# EAGLE design Output_v1.1 (EAGLE 9.6.1)
Assembly variants: test
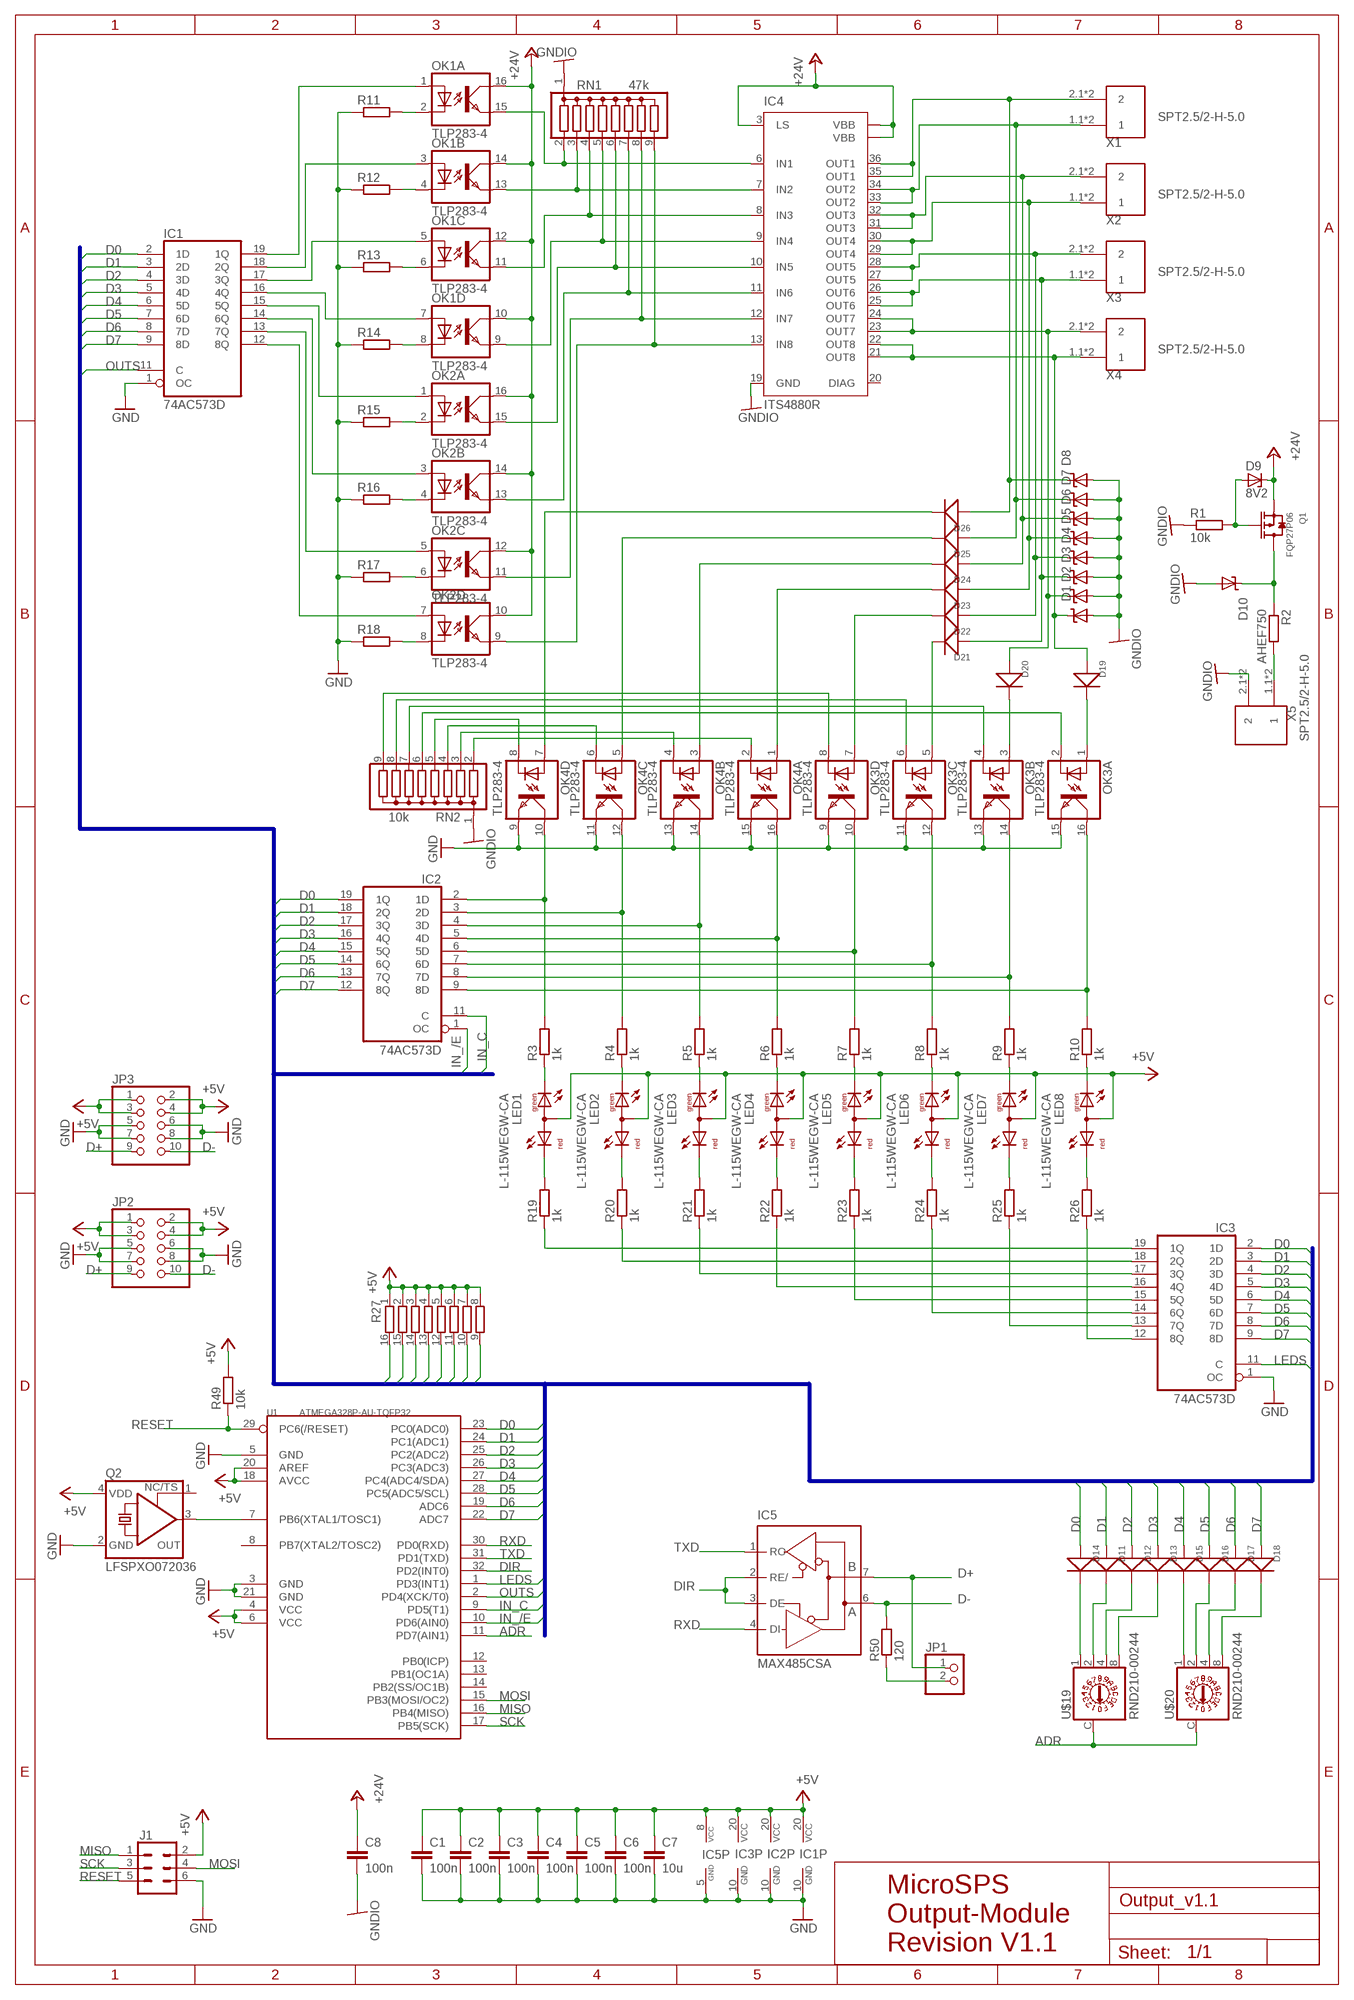
[diagram p0: schematic, sheet 1]

## Parts
C1  100n  C-EUC0805  [C0805]
C2  100n  C-EUC0805  [C0805]
C3  100n  C-EUC0805  [C0805]
C4  100n  C-EUC0805  [C0805]
C5  100n  C-EUC0805  [C0805]
C6  100n  C-EUC0805  [C0805]
C7  10u  C-EUC0805  [C0805]
C8  100n  C-EUC0805  [C0805]
D1  SUPPRESSOR-SMBJ  [SMBJ]
D2  SUPPRESSOR-SMBJ  [SMBJ]
D3  SUPPRESSOR-SMBJ  [SMBJ]
D4  SUPPRESSOR-SMBJ  [SMBJ]
D5  SUPPRESSOR-SMBJ  [SMBJ]
D6  SUPPRESSOR-SMBJ  [SMBJ]
D7  SUPPRESSOR-SMBJ  [SMBJ]
D8  SUPPRESSOR-SMBJ  [SMBJ]
D9  8V2  ZENER-DIODESOD80C  [SOD80C]
D10  SUPPRESSOR-SMBJ  [SMBJ]
D11  DIODE'1N4148-SMD'  [LL-34]
D12  DIODE'1N4148-SMD'  [LL-34]
D13  DIODE'1N4148-SMD'  [LL-34]
D14  DIODE'1N4148-SMD'  [LL-34]
D15  DIODE'1N4148-SMD'  [LL-34]
D16  DIODE'1N4148-SMD'  [LL-34]
D17  DIODE'1N4148-SMD'  [LL-34]
D18  DIODE'1N4148-SMD'  [LL-34]
D19  DIODE'1N4148-SMD'  [LL-34]
D20  DIODE'1N4148-SMD'  [LL-34]
D21  DIODE'1N4148-SMD'  [LL-34]
D22  DIODE'1N4148-SMD'  [LL-34]
D23  DIODE'1N4148-SMD'  [LL-34]
D24  DIODE'1N4148-SMD'  [LL-34]
D25  DIODE'1N4148-SMD'  [LL-34]
D26  DIODE'1N4148-SMD'  [LL-34]
IC1  74AC573D  [SO20W]
IC2  74AC573D  [SO20W]
IC3  74AC573D  [SO20W]
IC4  ITS4880R  [PG-DSO-36]
IC5  MAX485CSA  MAX481CSA  [SO08]
J1  CONN_03X2FEMALE_SMD  [2X3_SMD]
JP1  PINHD-1X2  [1X02]
JP2  PINHD-2X5/90  [2X05/90]
JP3  PINHD-2X5/90  [2X05/90]
LED1  L-115WEGW-CA  [DUOLED-A-3MM]
LED2  L-115WEGW-CA  [DUOLED-A-3MM]
LED3  L-115WEGW-CA  [DUOLED-A-3MM]
LED4  L-115WEGW-CA  [DUOLED-A-3MM]
LED5  L-115WEGW-CA  [DUOLED-A-3MM]
LED6  L-115WEGW-CA  [DUOLED-A-3MM]
LED7  L-115WEGW-CA  [DUOLED-A-3MM]
LED8  L-115WEGW-CA  [DUOLED-A-3MM]
OK1  TLP283-4  [MINI-FLAT-16]
OK2  TLP283-4  [MINI-FLAT-16]
OK3  TLP283-4  [MINI-FLAT-16]
OK4  TLP283-4  [MINI-FLAT-16]
Q1  FQP27P06  DIP-MOSFET-P-CH-60V-27A-FQP27P06(TO-220)TO-220V  [TO-220V]
Q2  LFSPXO072036  KXO-PXO/XO-56-56  [5.0X3.2_KXO-56]
R1  10k  R-EU_R0805  [R0805]
R2  AHEF750  R-EU_0204/7  [0204/7]
R3  1k  R-EU_R0805  [R0805]
R4  1k  R-EU_R0805  [R0805]
R5  1k  R-EU_R0805  [R0805]
R6  1k  R-EU_R0805  [R0805]
R7  1k  R-EU_R0805  [R0805]
R8  1k  R-EU_R0805  [R0805]
R9  1k  R-EU_R0805  [R0805]
R10  1k  R-EU_R0805  [R0805]
R11  R-EU_R0805  [R0805]
R12  R-EU_R0805  [R0805]
R13  R-EU_R0805  [R0805]
R14  R-EU_R0805  [R0805]
R15  R-EU_R0805  [R0805]
R16  R-EU_R0805  [R0805]
R17  R-EU_R0805  [R0805]
R18  R-EU_R0805  [R0805]
R19  1k  R-EU_R0805  [R0805]
R20  1k  R-EU_R0805  [R0805]
R21  1k  R-EU_R0805  [R0805]
R22  1k  R-EU_R0805  [R0805]
R23  1k  R-EU_R0805  [R0805]
R24  1k  R-EU_R0805  [R0805]
R25  1k  R-EU_R0805  [R0805]
R26  1k  R-EU_R0805  [R0805]
R27  4816P-T01  [4816P]
R49  10k  R-EU_R0805  [R0805]
R50  120  R-EU_R0805  [R0805]
RN1  47k  G08R  [SIL9]
RN2  10k  G08R  [SIL9]
U1  ATMEGA328P-AU-TQFP32  MCU-ATMEGA328P-AU(TQFP32)  [TQFP32-0.8-7X7MM]
U$19  RND210-00244  [RND210-00244]
U$20  RND210-00244  [RND210-00244]
X1  SPT2.5/2-H-5.0  [SPT2]
X2  SPT2.5/2-H-5.0  [SPT2]
X3  SPT2.5/2-H-5.0  [SPT2]
X4  SPT2.5/2-H-5.0  [SPT2]
X5  SPT2.5/2-H-5.0  [SPT2]

## Nets
+5V: C1.1 C2.1 C3.1 C4.1 C5.1 C6.1 C7.1 IC1.20(VCC) IC2.20(VCC) IC3.20(VCC) IC5.8(VCC) J1.2 JP2.1 JP2.2 JP2.3 JP2.4 JP3.1 JP3.2 JP3.3 JP3.4 LED1.2(A) LED2.2(A) LED3.2(A) LED4.2(A) LED5.2(A) LED6.2(A) LED7.2(A) LED8.2(A) Q2.4(VDD) R27.1 R27.2 R27.3 R27.4 R27.5 R27.6 R27.7 R27.8 R49.2 U1.4(VCC) U1.6(VCC) U1.18(AVCC) U1.20(AREF)
+24V: C8.1 D9.C IC4.3(LS) IC4.TH@1(VBB) IC4.TH@2(VBB) OK1.10(D:COL) OK1.12(C:COL) OK1.14(B:COL) OK1.16(A:COL) OK2.10(D:COL) OK2.12(C:COL) OK2.14(B:COL) OK2.16(A:COL) Q1.3(S)
ADR: U1.11(PD7(AIN1)) U$19.C U$20.C
D0: D14.A(+) IC1.2(1D) IC2.19(1Q) IC3.2(1D) R27.16 U1.23(PC0(ADC0))
D1: D11.A(+) IC1.3(2D) IC2.18(2Q) IC3.3(2D) R27.15 U1.24(PC1(ADC1))
D2: D12.A(+) IC1.4(3D) IC2.17(3Q) IC3.4(3D) R27.14 U1.25(PC2(ADC2))
D3: D13.A(+) IC1.5(4D) IC2.16(4Q) IC3.5(4D) R27.13 U1.26(PC3(ADC3))
D4: D15.A(+) IC1.6(5D) IC2.15(5Q) IC3.6(5D) R27.12 U1.27(PC4(ADC4/SDA))
D5: D16.A(+) IC1.7(6D) IC2.14(6Q) IC3.7(6D) R27.11 U1.28(PC5(ADC5/SCL))
D6: D17.A(+) IC1.8(7D) IC2.13(7Q) IC3.8(7D) R27.10 U1.19(ADC6)
D7: D18.A(+) IC1.9(8D) IC2.12(8Q) IC3.9(8D) R27.9 U1.22(ADC7)
D+: IC5.7(B) JP1.1 JP2.9 JP3.9
D-: IC5.6(A) JP2.10 JP3.10 R50.2
DIR: IC5.2(RE/) IC5.3(DE) U1.32(PD2(INT0))
GND: C1.2 C2.2 C3.2 C4.2 C5.2 C6.2 C7.2 IC1.1(OC) IC1.10(GND) IC2.10(GND) IC3.1(OC) IC3.10(GND) IC5.5(GND) J1.6 JP2.5 JP2.6 JP2.7 JP2.8 JP3.5 JP3.6 JP3.7 JP3.8 OK3.9(D:EMIT) OK3.11(C:EMIT) OK3.13(B:EMIT) OK3.15(A:EMIT) OK4.9(D:EMIT) OK4.11(C:EMIT) OK4.13(B:EMIT) OK4.15(A:EMIT) Q2.2(GND) R11.1 R12.1 R13.1 R14.1 R15.1 R16.1 R17.1 R18.1 U1.3(GND) U1.5(GND) U1.21(GND)
GNDIO: C8.2 D1.A D2.A D3.A D4.A D5.A D6.A D7.A D8.A D10.A IC4.19(GND) R1.1 RN1.1 RN2.1 X5.2.1 X5.2.2
IN_/E: IC2.1(OC) U1.10(PD6(AIN0))
IN_C: IC2.11(C) U1.9(PD5(T1))
LEDS: IC3.11(C) U1.1(PD3(INT1))
MISO: J1.1 U1.16(PB4(MISO))
MOSI: J1.4 U1.15(PB3(MOSI/OC2))
N$1: IC4.6(IN1) OK1.15(A:EMIT) RN1.2
N$2: IC4.7(IN2) OK1.13(B:EMIT) RN1.3
N$3: IC4.8(IN3) OK1.11(C:EMIT) RN1.4
N$4: IC4.9(IN4) OK1.9(D:EMIT) RN1.5
N$5: IC4.10(IN5) OK2.15(A:EMIT) RN1.6
N$6: IC4.11(IN6) OK2.13(B:EMIT) RN1.7
N$7: IC4.12(IN7) OK2.11(C:EMIT) RN1.8
N$8: IC4.13(IN8) OK2.9(D:EMIT) RN1.9
N$9: LED1.1(CG) R3.1
N$10: LED2.1(CG) R4.1
N$11: LED3.1(CG) R5.1
N$12: LED4.1(CG) R6.1
N$13: LED5.1(CG) R7.1
N$14: LED6.1(CG) R8.1
N$15: LED7.1(CG) R9.1
N$16: LED8.1(CG) R10.1
N$17: OK4.2(A:C) RN2.2
N$18: OK4.4(B:C) RN2.3
N$19: OK4.6(C:C) RN2.4
N$20: OK4.8(D:C) RN2.5
N$21: OK3.2(A:C) RN2.6
N$22: OK3.4(B:C) RN2.7
N$23: OK3.6(C:C) RN2.8
N$24: OK3.8(D:C) RN2.9
N$25: D10.C Q1.2(D) R2.1
N$26: D9.A Q1.1(G) R1.2
N$27: R2.2 X5.1.1 X5.1.2
N$28: D1.C D19.A(+) IC4.21(OUT8) IC4.22(OUT8) X4.1.1 X4.1.2
N$29: D2.C D20.A(+) IC4.23(OUT7) IC4.24(OUT7) X4.2.1 X4.2.2
N$30: D3.C D21.A(+) IC4.25(OUT6) IC4.26(OUT6) X3.1.1 X3.1.2
N$31: D4.C D22.A(+) IC4.27(OUT5) IC4.28(OUT5) X3.2.1 X3.2.2
N$32: D5.C D23.A(+) IC4.29(OUT4) IC4.30(OUT4) X2.1.1 X2.1.2
N$33: D6.C D24.A(+) IC4.31(OUT3) IC4.32(OUT3) X2.2.1 X2.2.2
N$34: D7.C D25.A(+) IC4.33(OUT2) IC4.34(OUT2) X1.1.1 X1.1.2
N$35: D8.C D26.A(+) IC4.35(OUT1) IC4.36(OUT1) X1.2.1 X1.2.2
N$36: IC2.2(1D) OK4.10(D:COL) R3.2
N$37: IC2.3(2D) OK4.12(C:COL) R4.2
N$38: IC2.4(3D) OK4.14(B:COL) R5.2
N$39: IC2.5(4D) OK4.16(A:COL) R6.2
N$40: IC2.6(5D) OK3.10(D:COL) R7.2
N$41: IC2.7(6D) OK3.12(C:COL) R8.2
N$42: IC2.8(7D) OK3.14(B:COL) R9.2
N$43: IC2.9(8D) OK3.16(A:COL) R10.2
N$44: IC3.19(1Q) R19.1
N$45: IC3.18(2Q) R20.1
N$46: IC3.17(3Q) R21.1
N$47: IC3.16(4Q) R22.1
N$48: IC3.15(5Q) R23.1
N$49: IC3.14(6Q) R24.1
N$50: IC3.13(7Q) R25.1
N$51: IC3.12(8Q) R26.1
N$52: LED1.3(CR) R19.2
N$53: LED2.3(CR) R20.2
N$54: OK1.2(A:C) R11.2
N$55: OK1.4(B:C) R12.2
N$56: OK1.6(C:C) R13.2
N$57: OK1.8(D:C) R14.2
N$58: OK2.2(A:C) R15.2
N$59: LED3.3(CR) R21.2
N$60: OK2.4(B:C) R16.2
N$61: OK2.6(C:C) R17.2
N$62: OK2.8(D:C) R18.2
N$63: IC1.17(3Q) OK1.5(C:A)
N$64: IC1.18(2Q) OK1.3(B:A)
N$65: IC1.19(1Q) OK1.1(A:A)
N$66: IC1.16(4Q) OK1.7(D:A)
N$67: IC1.15(5Q) OK2.1(A:A)
N$68: IC1.14(6Q) OK2.3(B:A)
N$69: IC1.13(7Q) OK2.5(C:A)
N$70: IC1.12(8Q) OK2.7(D:A)
N$71: LED4.3(CR) R22.2
N$72: LED5.3(CR) R23.2
N$73: LED6.3(CR) R24.2
N$74: LED7.3(CR) R25.2
N$75: LED8.3(CR) R26.2
N$76: D19.C(-) OK3.1(A:A)
N$77: D20.C(-) OK3.3(B:A)
N$78: D21.C(-) OK3.5(C:A)
N$79: D22.C(-) OK3.7(D:A)
N$80: D23.C(-) OK4.1(A:A)
N$81: D24.C(-) OK4.3(B:A)
N$82: D25.C(-) OK4.5(C:A)
N$83: D26.C(-) OK4.7(D:A)
N$97: Q2.3(OUT) U1.7(PB6(XTAL1/TOSC1))
N$99: JP1.2 R50.1
N$100: D14.C(-) U$19.1
N$101: D11.C(-) U$19.2
N$102: D12.C(-) U$19.4
N$103: D13.C(-) U$19.8
N$104: D15.C(-) U$20.1
N$105: D16.C(-) U$20.2
N$106: D17.C(-) U$20.4
N$107: D18.C(-) U$20.8
OUTS: IC1.11(C) U1.2(PD4(XCK/T0))
RESET: J1.5 R49.1 U1.29(PC6(/RESET))
RXD: IC5.4(DI) U1.30(PD0(RXD))
SCK: J1.3 U1.17(PB5(SCK))
TXD: IC5.1(RO) U1.31(PD1(TXD))
Unconnected: IC4.20(DIAG) Q2.1(TS) U1.8(PB7(XTAL2/TOSC2)) U1.12(PB0(ICP)) U1.13(PB1(OC1A)) U1.14(PB2(SS/OC1B))

## Buses
D0,D1,D2,D3,D4,D5,D6,D7,IN_C,IN_/E,LEDS,OUTS

## Notes on the sheet
- MicroSPS
  Output-Module
  Revision V1.1

## Library data of the parts
C1-C8 = rcl:C-EU: CAPACITOR, European symbol; SPICEPREFIX: C
D1-D8 D10 = diode:SUPPRESSOR-: Suppressor diode
D9 = diode:ZENER-DIODE: Z-Diode
D11-D26 = Seeed-OPL-Diode:DIODE*
IC1-IC3 = 74xx-eu:74*573: 8-bit D latch BUS DRIVER
IC4 = infineon:ITS4880R: Smart Power High-Side-Switch for Industrial Applications. Eight Channels: 8 x 200 mOhm Source: http://www.infineon.com .. ITS4880R_20060309.pdf; MPN: ITS4880R; OC_FARNELL: 1440818; OC_NEWARK: 58M7534
IC5 = maxim:MAX481CSA: RS485 TRANSEIVER; MF: MAXIM; MPN: MAX481CSA; OC_FARNELL: unknown; OC_NEWARK: 90C3817
J1 = SparkFun-Connectors:CONN_03X2: Multi connection point. Often used as Generic Header-pin footprint for 0.1 inch spaced/style header connections You can populate with any combo of single row headers, but if you'd like an exact match, check these: Header - 2x3 (Male, 0.1") <https://www.sparkfun.com/products/12807> (PRT-12807) Header - 2x3 (Female, 0.1") <https://www.sparkfun.com/products/13010> (PRT-13010) 2x3 Pin Shrouded Header <https://www.sparkfun.com/products/10877> (PRT-10877) On any of the 0.1 inch spaced packages, you can populate with these: Break Away Headers - Straight <https://www.sparkfun.com/products/116> (PRT-00116) Break Away Male Headers - Right Angle <https://www.sparkfun.com/products/553> (PRT-00553) Female Headers <https://www.sparkfun.com/products/115> (PRT-00115) Break Away Headers - Machine Pin <https://www.sparkfun.com/products/117> (PRT-00117) Break Away Female Headers - Swiss Machine Pin <https://www.sparkfun.com/products/743> (PRT-00743) Special note: the shrouded connector mates well with our 3x2 ribbon cables: Ribbon Crimp Connector - 6-pin (2x3, Female) <https://www.sparkfun.com/products/10651> (PRT-10651) Ribbon Cable - 6 wire (15ft) <https://www.sparkfun.com/products/10646> (PRT-10646); PROD_ID: CONN-11290
JP1 = pinhead:PINHD-1X2: PIN HEADER
JP2 JP3 = pinhead:PINHD-2X5: PIN HEADER
LED1-LED8 = led:L-115WEGW-CA: T-1(3mm) BI-COLOR INDICATOR LAMP Source: Kingbright .. 2_colour_led_.pdf
OK1-OK4 = optocoupler:TLP283-4: TOSHIBA PHOTOCOUPLER GaAs IRED & PHOTO-TRANSISTOR Source: http://www.semicon.toshiba.co.jp/td/en/Opto/Photocoupler/en_20050928_TLP283_datasheet.pdf; OC_FARNELL: unknown; OC_NEWARK: unknown
Q1 = Seeed-OPL-Transistor:DIP-MOSFET-P-CH-60V-27A-FQP27P06(TO-220): 305020016
Q2 = crystal-geyer_V1_0:KXO-PXO/XO-56: SSO Spread Spectrum Oscillator (PXO/XO) MHz : KXO - Serie Model Size l/w/h [mm] Frequency Range Frequency Stability Temp. Range [°C] Output AECQ 200 availabel Datasheet KXO-56 5.0/3.2/1.2 1,0 ~ 134,0 MHz ±25 … ±100ppm (*) -40°C …+85°C HCMOS - KXO-56.pdf <http://www.geyer-electronic.de/uploads/tx_userartikelfrequenz/GEYER-KXO-56.pdf> <http://www.geyer-electronic.de/fileadmin/template/img/logo-geyer-electronic.png> Details see: http://www.geyer-electronic.de/Frequenz-Produkte.9.0.html Created 2016-06-07, Hans Locher 2016 (C) Geyer Quartz Technology KXO56;5,0x3,2;5.0x3.2;5032
R1 R3-R26 R49 R50 = rcl:R-EU_: RESISTOR, European symbol; SPICEPREFIX: R
R2 = resistor:R-EU_: RESISTOR, European symbol
R27 = resistor-bourns:4816P-T01: BOURNS RESISTOR NETWORK; MF: BOURNS, INC.; MPN: 4816P-T01-684LF; OC_FARNELL: 9357483; OC_NEWARK: 33K0707
RN1 RN2 = resistor-sil:G08R: SIL RESISTOR; OC_FARNELL: unknown; OC_NEWARK: unknown
U1 = Seeed-OPL-ic:MCU-ATMEGA328P-AU(TQFP32): 310010049; MPN: ATMEGA328P-AU
U$19 U$20 = switch-dil:RND210-00244
X1-X5 = con-phoenix-500:SPT2.5/2-H-5.0: Phönix Contact SPT 2.5/ 2-H-5.0 Federzugklemme 2polig 5mm liegend 1990973

## Board
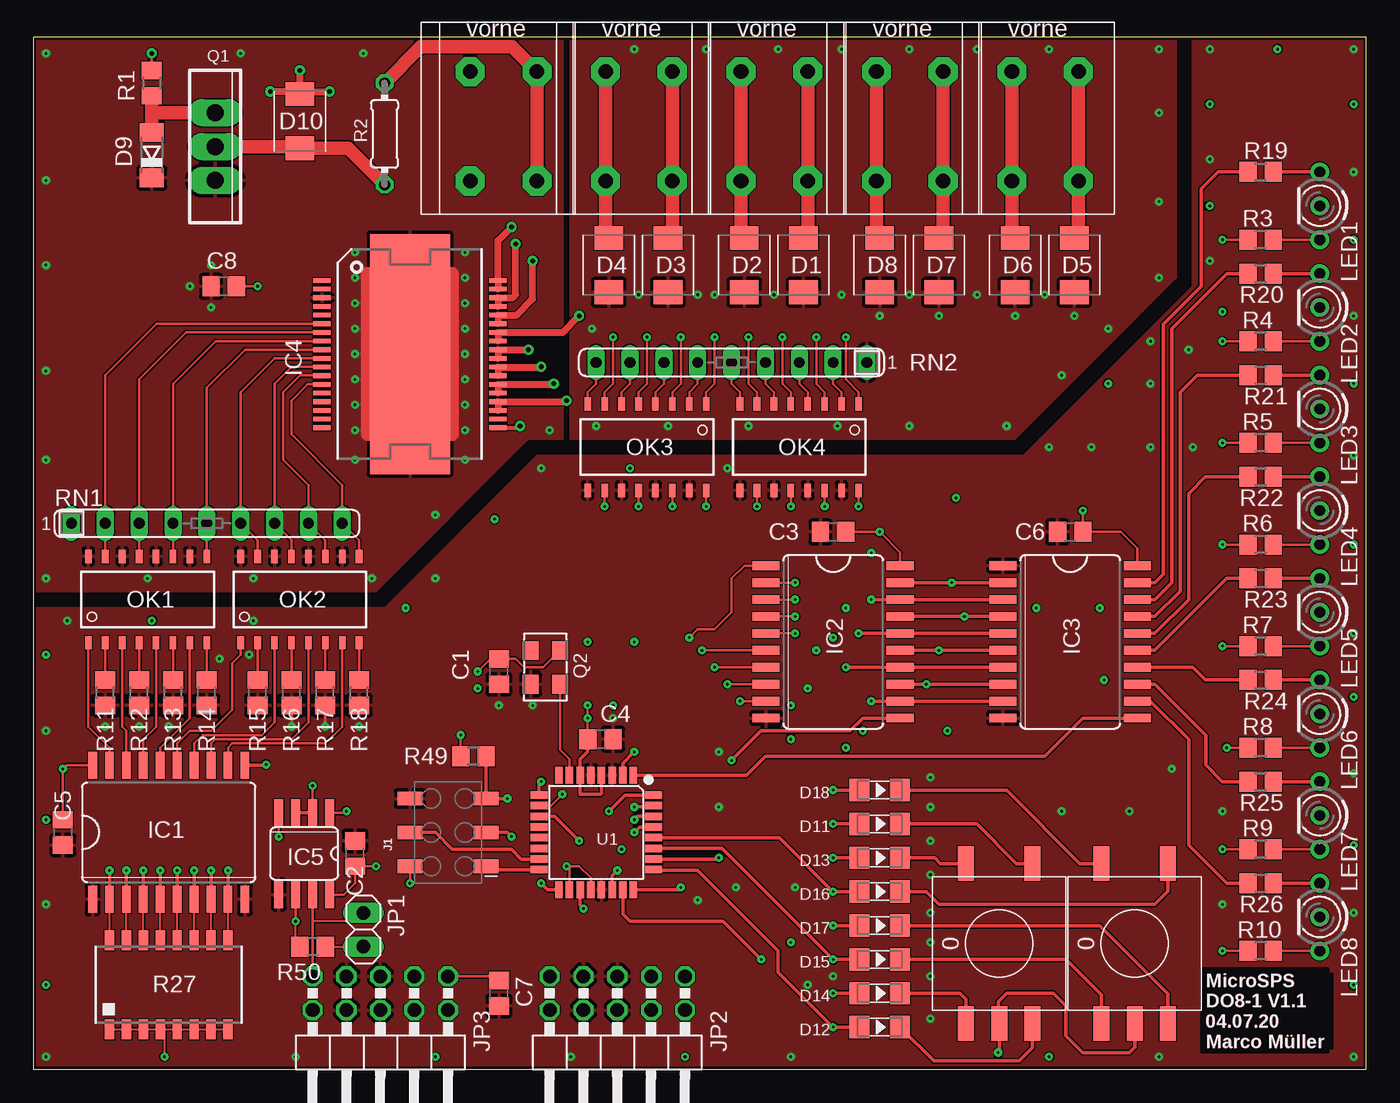
[diagram p1: board, top side]
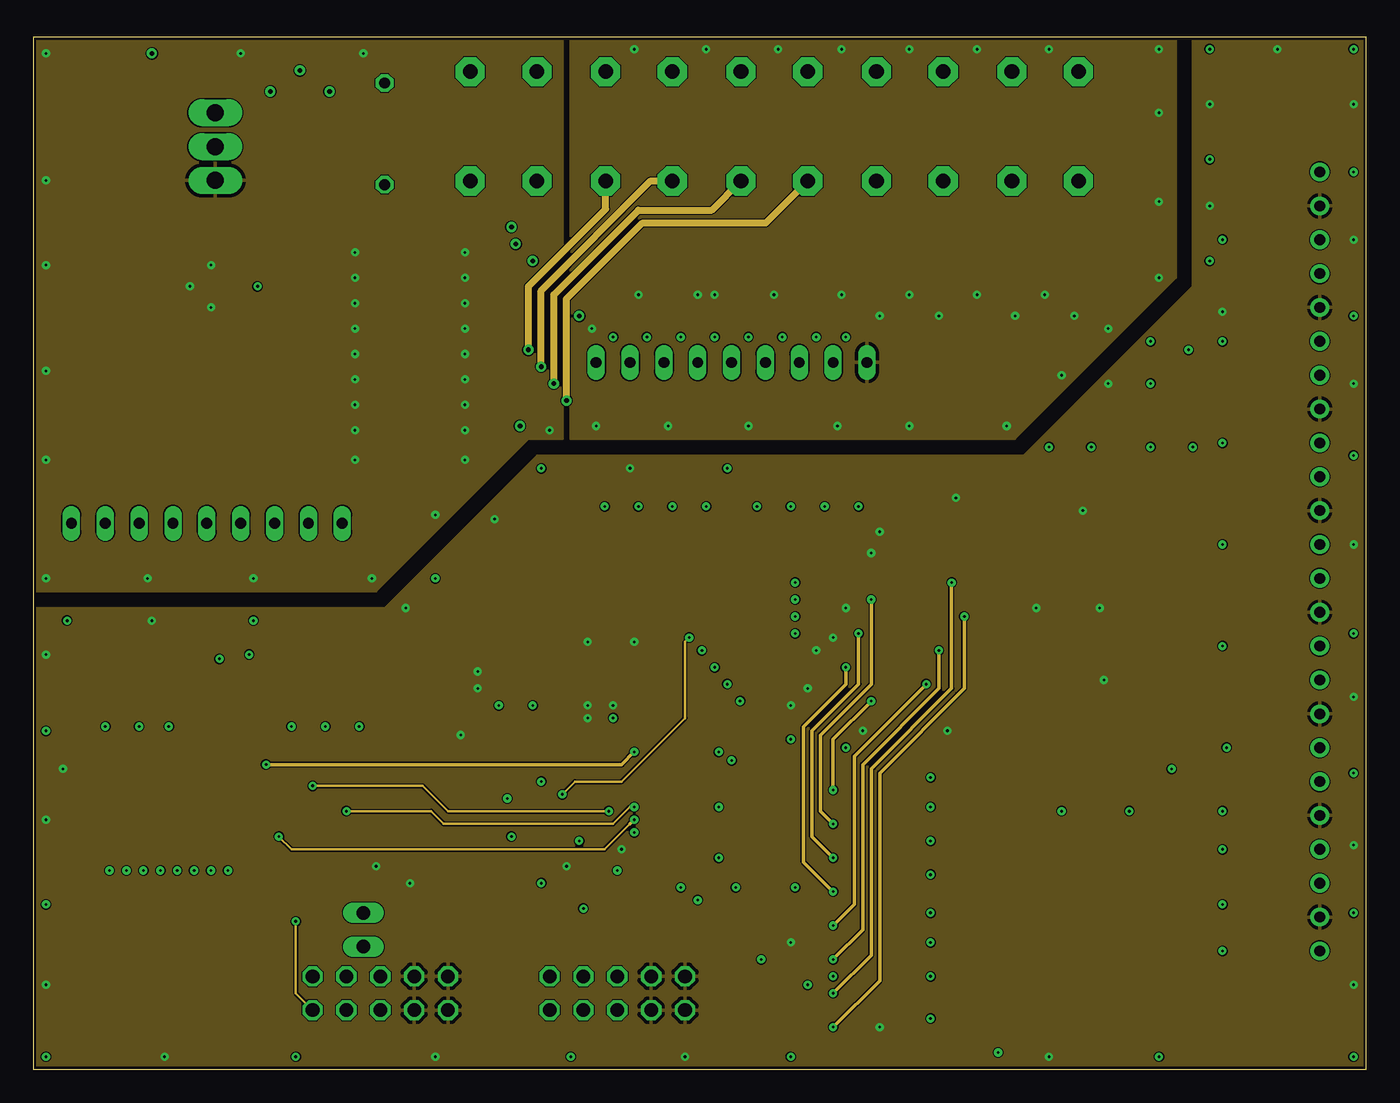
[diagram p2: board, inner layer Route2]
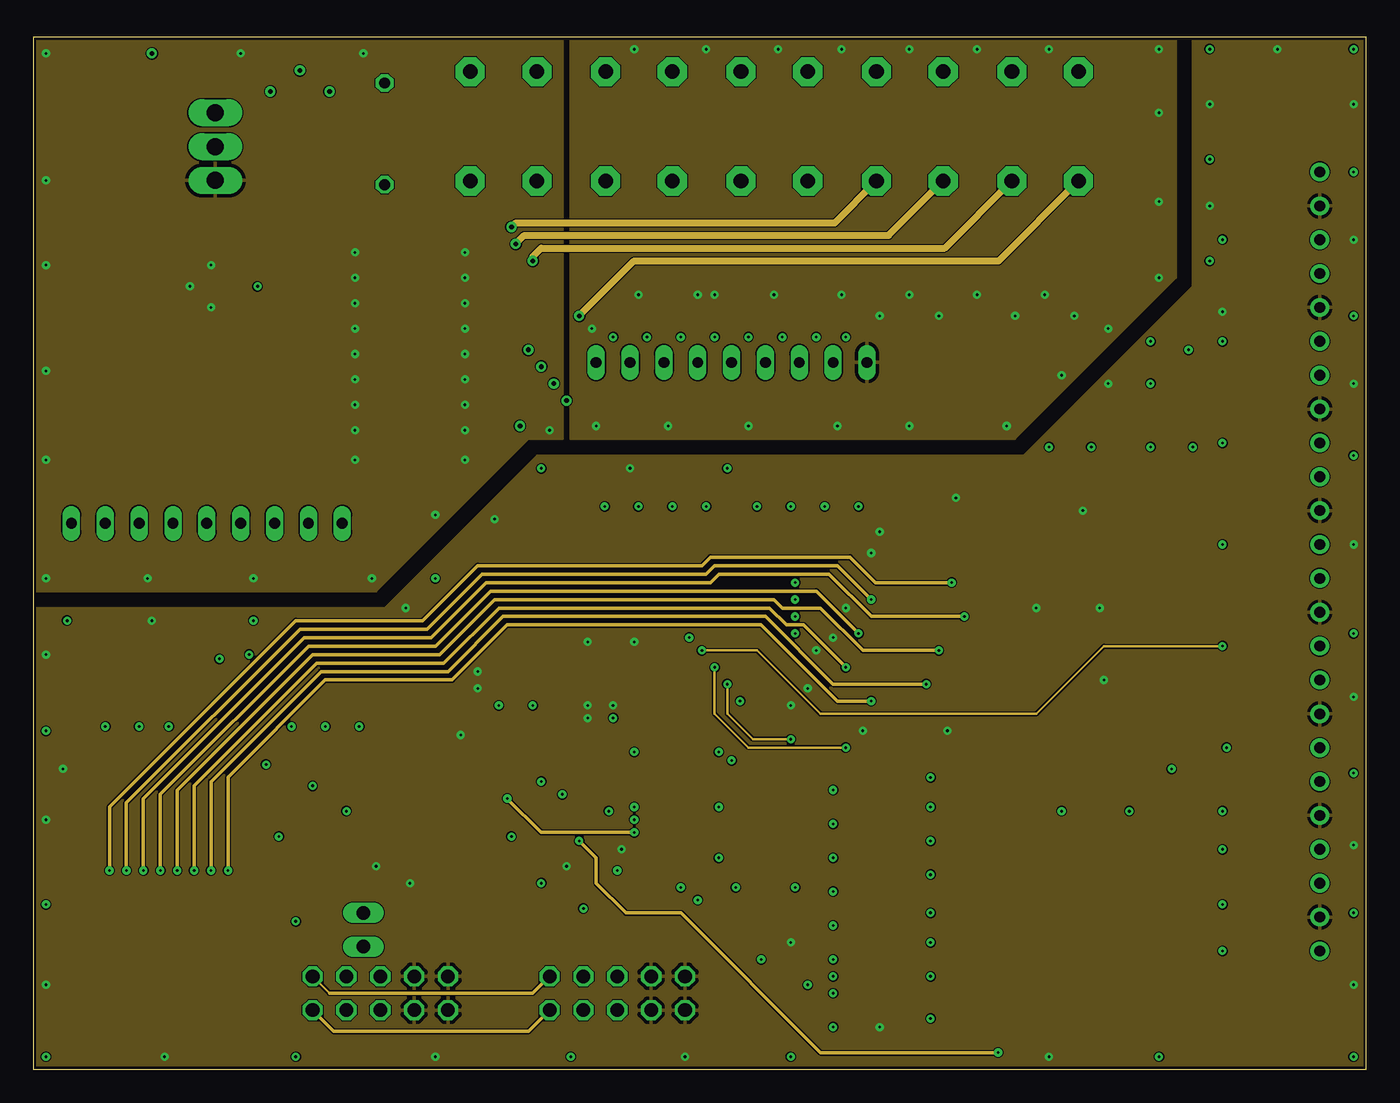
[diagram p3: board, inner layer Route15]
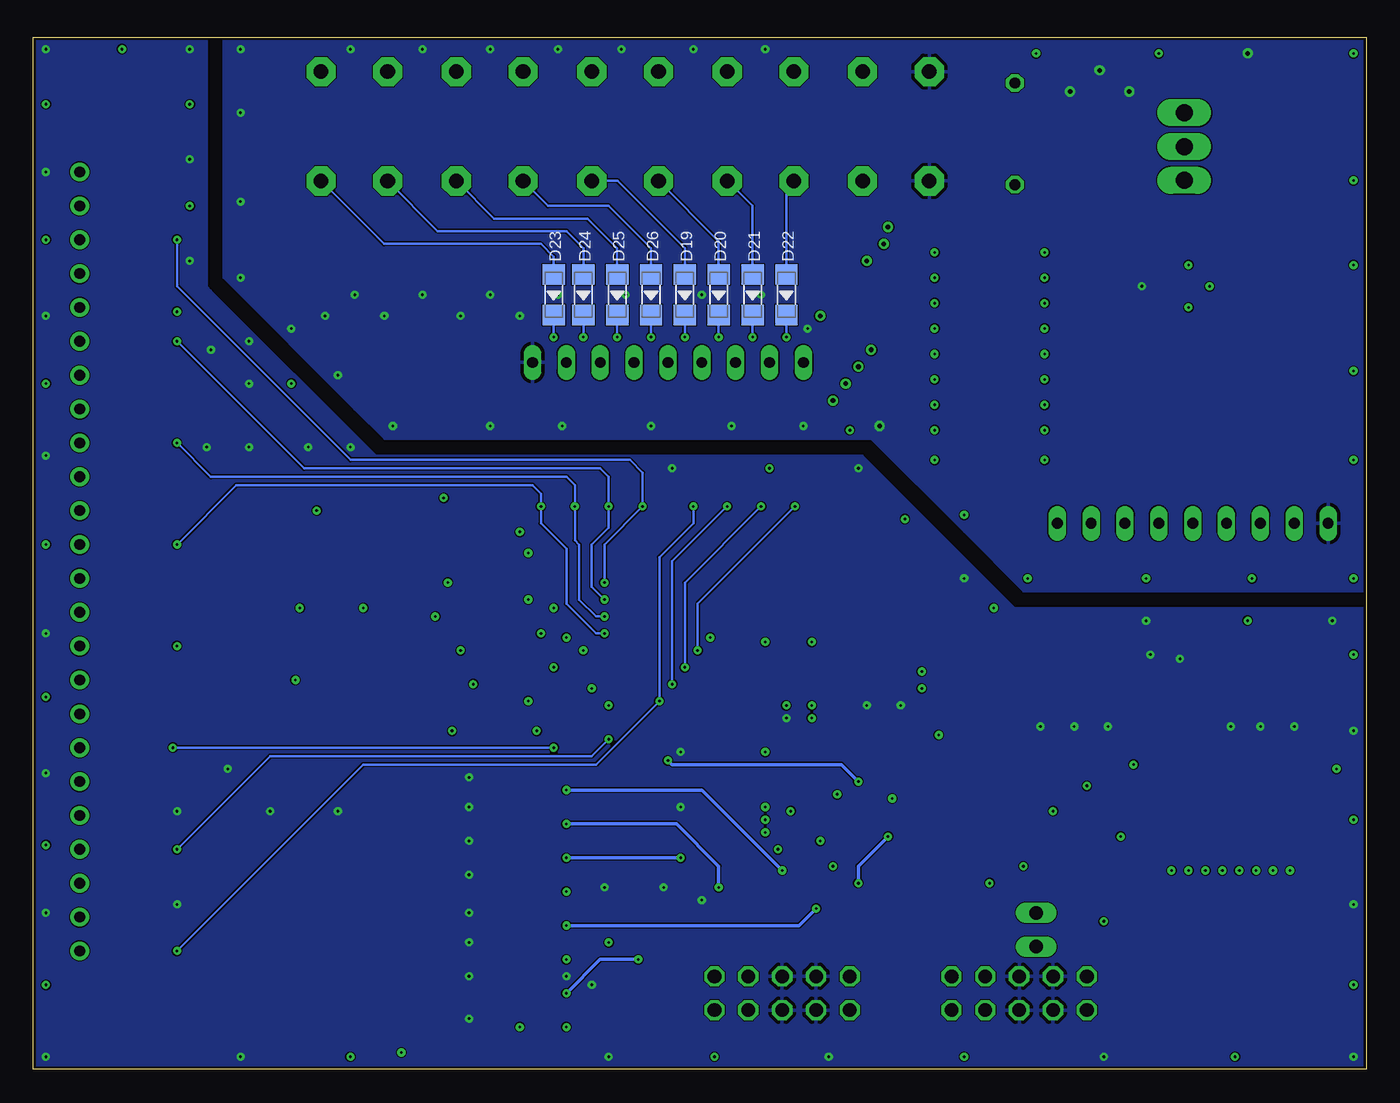
[diagram p4: board, bottom side, seen from below]

Size 100 x 77.4 mm. Coordinates in mm from the lower left corner, seen from the top.
Outline: 0,0 100,0 100,77.4 0,77.4 0,0
Copper layers (1+2*15+16): Top 0.035mm / dielectric 0.2mm / Route2 0.035mm / dielectric 1mm / Route15 0.035mm / dielectric 0.2mm / Bottom 0.035mm
Design rules "jlc *": minimum track width 3.5mil, minimum drill 0.2mm, track to track 3.5mil, track to pad 6mil, pad to pad 6mil, via to via 6mil, smd to smd 6mil, copper to edge 0.2mm, drill to drill 6mil, minimum pad ring 10mil, minimum via ring 8mil, stop-mask expansion 4mil, vias tented up to drill 0mil, thermal gap 10mil
tKeepout: 5 lines
tRestrict: 4 lines

### Footprints (pad centres in the part's own frame; a part is rotated, then mirrored left to right if it is on the bottom)
C0805 = smd 1.3 x 1.5: 1 -0.95,0; 2 0.95,0
SMBJ = smd 1.78 x 2.16: A 2.04,0; C -2.03,0
SOD80C = smd 1.4 x 1.8: A 1.7,0; C -1.7,0
LL-34 = smd 1.524 x 1.676: A -1.524,0; C 1.524,0
SO20W = smd 0.66 x 2.032: 1 -5.715,-5.029; 2 -4.445,-5.029; 3 -3.175,-5.029; 4 -1.905,-5.029; 5 -0.635,-5.029; 6 0.635,-5.029; 7 1.905,-5.029; 8 3.175,-5.029; 9 4.445,-5.029; 10 5.715,-5.029; 11 5.715,5.029; 12 4.445,5.029; 13 3.175,5.029; 14 1.905,5.029; 15 0.635,5.029; 16 -0.635,5.029; 17 -1.905,5.029; 18 -3.175,5.029; 19 -4.445,5.029; 20 -5.715,5.029
PG-DSO-36 = smd 0.35 x 1.3: 1 -5.525,-6.6; 2 -4.875,-6.6; 3 -4.225,-6.6; 4 -3.575,-6.6; 5 -2.925,-6.6; 6 -2.275,-6.6; 7 -1.625,-6.6; 8 -0.975,-6.6; 9 -0.325,-6.6; 10 0.325,-6.6; 11 0.975,-6.6; 12 1.625,-6.6; 13 2.275,-6.6; 14 2.925,-6.6; 15 3.575,-6.6; 16 4.225,-6.6; 17 4.875,-6.6; 18 5.525,-6.6; 19 5.525,6.6; 20 4.875,6.6; 21 4.225,6.6; 22 3.575,6.6; 23 2.925,6.6; 24 2.275,6.6; 25 1.625,6.6; 26 0.975,6.6; 27 0.325,6.6; 28 -0.325,6.6; 29 -0.975,6.6; 30 -1.625,6.6; 31 -2.275,6.6; 32 -2.925,6.6; 33 -3.575,6.6; 34 -4.225,6.6; 35 -4.875,6.6; 36 -5.525,6.6 | smd 9.5 x 6: TH@1 -4.25,0; TH@2 4.25,0
SO08 = smd 0.66 x 2.032: 1 -1.905,-3.073; 2 -0.635,-3.073; 3 0.635,-3.073; 4 1.905,-3.073; 5 1.905,3.073; 6 0.635,3.073; 7 -0.635,3.073; 8 -1.905,3.073
2X3_SMD = smd 1.02 x 1.9: 1 -2.54,-2.85; 2 -2.54,2.85; 3 0,-2.85; 4 0,2.85; 5 2.54,-2.85; 6 2.54,2.85
1X02 = drill 1.016 long: 1 -1.27,0; 2 1.27,0
2X05/90 = drill 1.016 octagon: 1 -5.08,-6.35; 2 -5.08,-3.81; 3 -2.54,-6.35; 4 -2.54,-3.81; 5 0,-6.35; 6 0,-3.81; 7 2.54,-6.35; 8 2.54,-3.81; 9 5.08,-6.35; 10 5.08,-3.81
DUOLED-A-3MM = drill 0.8 pad 1.4: 1 -2.54,0; 2 0,0; 3 2.54,0
MINI-FLAT-16 = smd 1 x 0.5: 1 -3.24,4.445; 2 -3.24,3.175; 3 -3.24,1.905; 4 -3.24,0.635; 5 -3.24,-0.635; 6 -3.24,-1.905; 7 -3.24,-3.175; 8 -3.24,-4.445; 9 3.24,-4.445; 10 3.24,-3.175; 11 3.24,-1.905; 12 3.24,-0.635; 13 3.24,0.635; 14 3.24,1.905; 15 3.24,3.175; 16 3.24,4.445
TO-220V = drill 1.27 pad 2.032 long: 1 -2.54,0; 2 0,0; 3 2.54,0
5.0X3.2_KXO-56 = smd 1.4 x 1.2: 1 -1.27,-1.1; 2 1.27,-1.1; 3 1.27,1.1; 4 -1.27,1.1
R0805 = smd 1.3 x 1.5: 1 -0.95,0; 2 0.95,0
0204/7 = drill 0.813 octagon: 1 -3.81,0; 2 3.81,0
4816P = smd 0.7 x 1.5: 1 -4.445,-3.346; 2 -3.175,-3.346; 3 -1.905,-3.346; 4 -0.635,-3.346; 5 0.635,-3.346; 6 1.905,-3.346; 7 3.175,-3.346; 8 4.445,-3.346; 9 4.445,3.346; 10 3.175,3.346; 11 1.905,3.346; 12 0.635,3.346; 13 -0.635,3.346; 14 -1.905,3.346; 15 -3.175,3.346; 16 -4.445,3.346
SIL9 = drill 0.813 long: 1 -10.16,0; 2 -7.62,0; 3 -5.08,0; 4 -2.54,0; 5 0,0; 6 2.54,0; 7 5.08,0; 8 7.62,0; 9 10.16,0
TQFP32-0.8-7X7MM = smd 1.27 x 0.559: 1 -4.293,2.8; 2 -4.293,2; 3 -4.293,1.2; 4 -4.293,0.4; 5 -4.293,-0.4; 6 -4.293,-1.2; 7 -4.293,-2; 8 -4.293,-2.8; 17 4.293,-2.8; 18 4.293,-2; 19 4.293,-1.2; 20 4.293,-0.4; 21 4.293,0.4; 22 4.293,1.2; 23 4.293,2; 24 4.293,2.8 | smd 0.559 x 1.27: 9 -2.8,-4.293; 10 -2,-4.293; 11 -1.2,-4.293; 12 -0.4,-4.293; 13 0.4,-4.293; 14 1.2,-4.293; 15 2,-4.293; 16 2.8,-4.293; 25 2.8,4.293; 26 2,4.293; 27 1.2,4.293; 28 0.4,4.293; 29 -0.4,4.293; 30 -1.2,4.293; 31 -2,4.293; 32 -2.8,4.293
RND210-00244 = smd 2.6 x 1.2: 1 -1,7.5; 2 11,2.5; 4 -1,2.5; 8 11,7.5; C -1,5
SPT2 = drill 1.1 pad 2.184 octagon: 1.1 7.3,10.7; 1.2 7.3,2.5; 2.1 2.3,10.7; 2.2 2.3,2.5

### Placement (x,y rotation side)
C1  34.92,29.84 270 top
C2  24.13,16.19 90 top
C3  60.01,40.32 180 top
C4  42.55,24.77 0 top
C5  2.22,17.78 270 top
C6  77.79,40.32 180 top
C7  34.92,5.71 270 top
C8  14.29,58.74 0 top
D1  57.78,60.33 270 top
D2  53.34,60.33 270 top
D3  47.62,60.33 270 top
D4  43.18,60.33 270 top
D5  78.11,60.33 270 top
D6  73.66,60.33 270 top
D7  67.94,60.33 270 top
D8  63.5,60.33 270 top
D9  8.89,68.58 90 top
D10  20,71.12 90 top
D11  63.5,18.41 0 top
D12  63.5,3.17 0 top
D13  63.5,15.88 0 top
D14  63.5,5.71 0 top
D15  63.5,8.26 0 top
D16  63.5,13.34 0 top
D17  63.5,10.79 0 top
D18  63.5,20.95 0 top
D19  51.12,58.1 270 bottom
D20  48.58,58.1 270 bottom
D21  46.04,58.1 270 bottom
D22  43.5,58.1 270 bottom
D23  60.96,58.1 270 bottom
D24  58.74,58.1 270 bottom
D25  56.2,58.1 270 bottom
D26  53.66,58.1 270 bottom
IC1  10.16,17.78 0 top
IC2  60.01,32.07 270 top
IC3  77.79,32.07 270 top
IC4  28.26,53.66 270 top
IC5  20.32,16.19 180 top
J1  31.11,17.78 90 top
JP1  24.77,10.48 270 top
JP2  43.81,0.64 180 top
JP3  26.04,0.64 180 top
LED1  96.52,64.77 90 top
LED2  96.52,57.15 90 top
LED3  96.52,49.53 90 top
LED4  96.52,41.91 90 top
LED5  96.52,34.29 90 top
LED6  96.52,26.67 90 top
LED7  96.52,19.05 90 top
LED8  96.52,11.43 90 top
OK1  8.57,35.24 90 top
OK2  20,35.24 90 top
OK3  46.04,46.67 270 top
OK4  57.47,46.67 270 top
Q1  13.65,69.22 270 top
Q2  38.42,30.16 270 top
R1  8.89,73.98 270 top
R2  26.35,70.17 90 top
R3  92.08,62.23 180 top
R4  92.08,54.61 180 top
R5  92.08,46.99 180 top
R6  92.08,39.37 180 top
R7  92.08,31.75 180 top
R8  92.08,24.13 180 top
R9  92.08,16.51 180 top
R10  92.08,8.89 180 top
R11  5.4,28.26 90 top
R12  7.94,28.26 90 top
R13  10.48,28.26 90 top
R14  13.02,28.26 90 top
R15  16.83,28.26 90 top
R16  19.37,28.26 90 top
R17  21.91,28.26 90 top
R18  24.45,28.26 90 top
R19  92.08,67.31 0 top
R20  92.08,59.69 0 top
R21  92.08,52.07 0 top
R22  92.08,44.45 0 top
R23  92.08,36.83 0 top
R24  92.08,29.21 0 top
R25  92.08,21.59 0 top
R26  92.08,13.97 0 top
R27  10.16,6.35 0 top
R49  33.02,23.5 180 top
R50  20.95,9.21 180 top
RN1  13.02,40.96 0 top
RN2  52.39,53.02 180 top
U1  42.23,17.78 270 top
U$19  77.47,4.45 90 top
U$20  87.63,4.45 90 top
X1  60.96,64.14 0 top
X2  71.12,64.14 0 top
X3  40.64,64.14 0 top
X4  50.8,64.14 0 top
X5  30.48,64.14 0 top

### Tracks (layer width: path | path; a pad name or v marks a point on that pad's centre or on a via)
+5V  (via drill 0.2)
  Top 0.152: R27.1 R27.2 R27.3 R27.4 | R27.4 R27.5 R27.6 R27.7 R27.8 | v9.84,0.95 9.84,2.69 R27.4
  Top 0.2: IC5.8 23.28,13.12 24.13,13.97 C2.1 v25.72,15.24 | C5.1 v2.22,22.54 2.49,22.81 IC1.20 | J1.2 v28.26,13.97 | R49.2 v32.07,25.08 | Q2.4 38.25,30.16 36.83,30.16 36.2,30.8 C1.1 34.29,30.8 v33.34,29.84 | IC2.20 65.04,38.79 v63.5,40.32 C3.1 | IC3.20 82.82,39.1 81.6,40.32 C6.1 v78.74,41.91 | JP3.1 34.6,6.99 C7.1 | C4.1 v41.59,26.35 v41.59,27.3 | v40.01,15.24 40.32,15.24 | 40.32,15.24 40.96,15.24 41.83,14.37 U1.20 | U1.18 40.23,15.14 40.32,15.24
  Top 0.254: U1.4 42.63,20.72 42.55,20.64 41.03,20.64 U1.6 41.03,23.25 41.59,23.82 C4.1
  other vias: 0.95,6.35 0.95,18.73 0.95,31.11 8.89,33.66 27.94,34.61 34.61,41.27 44.77,45.09 69.22,42.86 80.64,51.44 89.22,56.83 88.27,64.77 88.27,72.39 93.34,76.52 99.06,72.39 99.06,62.23 99.06,51.44 99.06,39.37 99.06,27.94 99.06,16.83 99.06,6.35 76.2,0.95 63.5,3.17 48.9,0.95 30.16,0.95 44.13,16.51 68.58,25.4 62.23,25.4 56.83,27.3 58.1,28.57 58.74,31.43 60.01,32.38 60.96,34.61 80.33,29.21 80.01,34.61 75.25,34.61 62.87,38.73 43.5,27.3 56.83,9.53 45.09,32.07 41.59,32.07 33.34,28.57
  pour Route15: 0,0 0,34.61 26.35,34.61 37.78,46.04 74.3,46.04 87,58.74 87,77.15 87,77.47 100.01,77.47 100.01,0
  pour Route2: 0,0 0,34.61 26.35,34.61 37.78,46.04 74.3,46.04 87,58.74 87,77.47 100.01,77.47 100.01,0
+24V  (via drill 0.2)
  Top 1.016: IC4.TH@1 26.48,59.69 25.08,59.69 25.08,47.62 31.43,47.62 31.43,59.69 30.16,59.69
  other vias: 24.13,45.72 32.38,45.72 32.38,47.94 32.38,49.85 32.38,51.75 32.38,53.66 32.38,55.56 32.38,57.47 32.38,59.37 32.38,61.28 24.13,47.94 24.13,49.85 24.13,51.75 24.13,53.66 24.13,55.56 24.13,57.47 24.13,59.37 24.13,61.28 11.75,58.74 13.34,60.33 13.34,57.15 0.95,36.83 8.57,36.83 16.51,36.83 25.4,36.83 30.16,41.59 38.73,47.94 0.95,45.72 0.95,52.39 0.95,60.33 0.95,66.67 0.95,76.2 15.56,76.2 24.77,76.2
  pour Top: 0.32,77.47 39.69,77.47 39.69,47.31 37.15,47.31 36.83,46.99 25.72,35.88 20.32,35.88 0,35.88 0,77.47
  pour Route2: 0,35.88 25.72,35.88 37.15,47.31 39.69,47.31 39.69,77.47 0,77.47
  pour Route15: 0,35.88 25.72,35.88 37.15,47.31 39.69,47.31 39.69,77.47 0,77.47
ADR  (via drill 0.2)
  Top 0.254: U$20.C 82.63,1.67 82.23,1.27 78.74,1.27 77.47,2.54 77.47,4.76 76.52,5.71 73.03,5.71 72.39,5.08 72.39,3.52 U$19.C 72.47,1.35 v72.39,1.27 | U1.11 39.12,18.98 v40.96,17.14
  Route15 0.254: v40.96,17.14 42.23,15.88 42.23,13.97 44.45,11.75 48.58,11.75 59.05,1.27 v72.39,1.27
D0  (via drill 0.2)
  Top 0.152: R27.16 IC1.2
  Top 0.254: IC2.19 v68.9,36.51 IC3.2 | D14.A v60.01,5.71 | IC1.2 v5.71,14.92 | U1.23 44.23,11.65 44.77,11.11 51.75,11.11 v54.61,8.26
  Route2 0.254: v60.01,5.71 62.87,8.57 62.87,22.54 68.9,28.57 v68.9,36.51
  Route15 0.254: v5.71,14.92 5.71,19.68 19.68,33.66 29.21,33.66 33.34,37.78 50.16,37.78 50.8,38.42 61.28,38.42 63.18,36.51 v68.9,36.51
  Bottom 0.254: v54.61,8.26 57.47,8.26 v60.01,5.71
D1  (via drill 0.2)
  Top 0.152: R27.15 IC1.3
  Top 0.254: IC3.3 IC2.18 v62.87,35.24 | D11.A v60.01,18.41 | IC1.3 v6.99,14.92 | U1.24 48.41,13.49 v48.58,13.65
  Route2 0.254: v60.01,18.41 59.05,19.37 59.05,25.08 62.87,28.89 v62.87,35.24
  Route15 0.254: v6.99,14.92 6.99,20 20,33.02 29.53,33.02 33.66,37.15 50.48,37.15 51.12,37.78 60.33,37.78 v62.87,35.24
  Bottom 0.254: v48.58,13.65 48.58,15.24 51.75,18.41 v60.01,18.41
D2  (via drill 0.2)
  Top 0.152: R27.14 IC1.4
  Top 0.254: IC2.17 v69.85,33.97 IC3.4 | D12.A v60.01,3.17 55.88,7.3 55.88,8.89 49.85,14.92 46.58,14.92 U1.25 | IC1.4 v8.26,14.92
  Route2 0.254: v60.01,3.17 63.5,6.67 63.5,22.23 69.85,28.57 v69.85,33.97
  Route15 0.254: v8.26,14.92 8.26,20.32 20.32,32.38 29.84,32.38 33.97,36.51 50.8,36.51 51.44,37.15 56.83,37.15 59.69,37.15 62.87,33.97 v69.85,33.97
D3  (via drill 0.2)
  Top 0.152: R27.13 IC1.5
  Top 0.254: IC3.5 IC2.16 v61.91,32.7 | D13.A v60.01,15.88 | IC1.5 v9.53,14.92 | U1.26 51.34,15.78 v51.44,15.88
  Route2 0.254: v60.01,15.88 58.42,17.46 58.42,25.4 61.91,28.89 v61.91,32.7
  Route15 0.254: v9.53,14.92 9.53,20.64 20.64,31.75 30.16,31.75 34.29,35.88 58.74,35.88 v61.91,32.7
  Bottom 0.254: v51.44,15.88 v60.01,15.88
D4  (via drill 0.2)
  Top 0.152: R27.12 IC1.6
  Top 0.254: IC2.15 v67.94,31.43 IC3.6 | D15.A v60.01,8.26 51.68,16.58 U1.27 | IC1.6 v10.79,14.92
  Route2 0.254: v60.01,8.26 62.23,10.48 62.23,22.86 67.94,28.57 v67.94,31.43
  Route15 0.254: v10.79,14.92 10.79,20.95 20.95,31.11 30.48,31.11 34.61,35.24 55.56,35.24 56.2,34.61 59.05,34.61 62.23,31.43 v67.94,31.43
D5  (via drill 0.2)
  Top 0.152: R27.11 IC1.7
  Top 0.254: IC3.7 IC2.14 v60.96,30.16 | D16.A v60.01,13.34 55.96,17.38 U1.28 | IC1.7 v12.06,14.92
  Route2 0.254: v60.01,13.34 57.78,15.56 57.78,25.72 60.96,28.89 v60.96,30.16
  Route15 0.254: v12.06,14.92 12.06,21.27 21.27,30.48 30.8,30.48 34.92,34.61 55.24,34.61 56.52,33.34 57.78,33.34 v60.96,30.16
D6  (via drill 0.2)
  Top 0.152: R27.10 IC1.8
  Top 0.254: IC2.13 v66.99,28.89 IC3.8 | D17.A v60.01,10.79 | IC1.8 v13.34,14.92 | U1.19 41.03,12.31 v41.27,12.06
  Route2 0.254: v60.01,10.79 61.59,12.38 61.59,23.5 v66.99,28.89
  Route15 0.254: v13.34,14.92 13.34,21.59 21.59,29.84 31.11,29.84 35.24,33.97 54.93,33.97 60.01,28.89 v66.99,28.89
  Bottom 0.254: v41.27,12.06 42.55,10.79 v60.01,10.79
D7  (via drill 0.2)
  Top 0.152: R27.9 IC1.9
  Top 0.254: IC3.9 IC2.12 v62.87,27.62 | D18.A v60.01,20.95 | IC1.9 v14.61,14.92 | U1.22 43.43,14.54 v43.81,14.92
  Route2 0.254: v60.01,20.95 60.01,24.77 v62.87,27.62
  Route15 0.254: v62.87,27.62 60.33,27.62 54.61,33.34 35.56,33.34 31.43,29.21 21.91,29.21 14.61,21.91 v14.61,14.92
  Bottom 0.254: v43.81,14.92 49.85,20.95 v60.01,20.95
D+
  Top 0.152: JP1.1 24.13,11.11 20.95,11.11
  Top 0.2: IC5.7 20.95,11.11 JP3.9
  Route15 0.2: 22.23,5.71 JP3.9
  Route15 0.254: JP2.9 37.47,5.71 22.23,5.71
D-  (via drill 0.2)
  Top 0.152: R50.2 19.68,9.53 v19.68,11.11
  Top 0.2: IC5.6 v19.68,11.11
  Route2 0.2: v19.68,11.11 19.68,5.71 JP3.10
  Route15 0.254: JP3.10 22.54,2.86 37.15,2.86 JP2.10
DIR  (via drill 0.2)
  Top 0.2: IC5.2 v20.95,21.27
  Top 0.254: IC5.3 IC5.2 | U1.32 44.39,20.58 v43.18,19.37
  Route2 0.2: v20.95,21.27 29.21,21.27 31.11,19.37 v43.18,19.37
GND  (via drill 0.2)
  Top 0.2: R16.1 v19.37,25.72 | R17.1 v21.91,25.72
  other vias: 0.95,0.95 0.95,12.38 0.95,25.4 2.54,33.66 16.51,33.66 30.16,36.83 38.1,45.09 52.07,45.09 76.2,46.67 83.82,54.61 83.82,51.44 79.38,46.67 83.82,46.67 87,46.67 86.68,53.98 88.27,60.64 88.27,68.26 88.27,76.52 99.06,76.52 99.06,67.31 99.06,56.52 99.06,46.04 99.06,32.7 99.06,22.23 99.06,11.75 99.06,0.95 84.45,0.95 56.83,0.95 40.32,0.95 19.68,0.95 5.4,25.72 7.94,25.72 10.16,25.72 13.97,30.8 16.19,31.11 24.45,25.72 37.47,27.3 34.92,27.3 43.5,26.35 51.44,23.81 51.44,19.68 57.15,13.65 52.7,13.65 49.85,12.7 58.1,6.35 60.01,6.99 67.31,3.81 67.31,6.99 67.31,9.53 67.31,11.75 67.31,14.61 67.31,17.14 67.31,19.68 67.31,21.91 77.15,19.37 82.23,19.37 85.41,22.54 89.22,19.37 89.22,12.38
  pour Bottom: 0,0 0,34.61 26.35,34.61 37.78,46.04 74.3,46.04 86.68,58.42 87,58.74 87,77.47 100.01,77.47 100.01,0
  pour Top: 0,0 0,34.61 26.35,34.61 37.78,46.04 74.3,46.04 75.56,47.31 87,58.74 87,77.15 87,77.47 100.01,77.47 100.01,0
GNDIO  (via drill 0.2, 0.35)
  Top 0.2: R1.1 v8.89,76.2 | C8.2 v16.83,58.74
  Top 0.305: IC4.19 36.38,48.13 v36.51,48.26
  Top 0.508: D10.A v20,74.93 | D10.A 20.18,73.34 v22.23,73.34 | D10.A 19.87,73.3 19.87,73.48 19.73,73.34 v17.78,73.34
  other vias: 42.23,48.26 47.62,48.26 53.66,48.26 60.33,48.26 65.72,48.26 73.03,48.26 77.15,52.07 80.64,55.56 84.45,59.37 84.45,65.09 84.45,71.75 84.45,76.52 76.2,76.52 70.8,76.52 65.72,76.52 60.64,76.52 55.88,76.52 50.48,76.52 45.09,76.52 63.5,56.52 67.94,56.52 73.66,56.52 78.11,56.52 70.8,58.1 65.72,58.1 75.88,58.1 45.4,58.1 49.85,58.1 51.12,58.1 55.56,58.1 60.64,58.1 41.91,55.56
  pour Bottom: 0,35.88 25.72,35.88 30.16,40.32 37.15,47.31 43.18,47.31 73.66,47.31 75.88,49.53 85.72,59.37 85.72,77.47 0,77.47
  pour Top: 40.32,47.31 40.32,77.47 85.72,77.47 85.72,59.37 73.66,47.31
  pour Route15: 40.32,47.31 73.66,47.31 85.72,59.37 85.72,77.47 40.32,77.47
  pour Route2: 40.32,47.31 73.66,47.31 85.72,59.37 85.72,77.47 40.32,77.47
IN_/E  (via drill 0.2)
  Top 0.2: U1.10 38.83,19.78 v39.69,20.64 | v49.21,32.38 49.85,33.02 51.12,33.02 52.39,34.29 52.39,36.83 53.34,37.78 IC2.1
  Route2 0.2: v39.69,20.64 40.64,21.59 44.13,21.59 48.9,26.35 48.9,32.07 v49.21,32.38
IN_C  (via drill 0.2)
  Top 0.254: U1.9 37.94,21.43 v38.1,21.59 | v52.39,23.18 54.61,25.4 61.28,25.4 62.23,26.35 IC2.11
  Bottom 0.254: v38.1,21.59 39.37,22.86 52.07,22.86 v52.39,23.18
LEDS
  Top 0.254: U1.1 53.51,22.07 54.93,23.5 75.88,23.5 78.74,26.35 IC3.11
MISO
  Top 0.254: J1.1 34.23,14.98 U1.16
MOSI
  Top 0.254: J1.4 30.16,17.78 31.43,16.51 35.88,16.51 36.61,15.78 U1.15
N$1
  Top 0.2: IC4.6 9.26,55.93 5.4,52.07 RN1.2 OK1.15
N$2
  Top 0.2: IC4.7 11.47,55.28 7.94,51.75 RN1.3 OK1.13
N$3
  Top 0.2: IC4.8 13.68,54.63 10.48,51.44 RN1.4 OK1.11
N$4
  Top 0.2: IC4.9 15.88,53.98 13.02,51.12 RN1.5 OK1.9
N$5
  Top 0.2: IC4.10 18.09,53.33 15.56,50.8 RN1.6 16.83,39.69 OK2.15
N$6
  Top 0.152: 21.64,52.7 IC4.11
  Top 0.2: 21.64,52.7 19.37,52.7 18.1,51.44 RN1.7 19.37,39.69 OK2.13
N$7
  Top 0.152: 21.62,52.07 IC4.12
  Top 0.2: 21.62,52.07 20,52.07 18.73,50.8 18.73,45.72 20.64,43.81 RN1.8 21.91,39.69 OK2.11
N$8
  Top 0.2: IC4.13 20.59,51.38 19.37,50.16 19.37,47.62 23.18,43.81 RN1.9 24.45,39.69 OK2.9
N$9
  Top 0.2: R3.1 LED1.1
N$10
  Top 0.2: R4.1 LED2.1
N$11
  Top 0.2: R5.1 LED3.1
N$12
  Top 0.2: R6.1 LED4.1
N$13
  Top 0.2: R7.1 LED5.1
N$14
  Top 0.2: R8.1 LED6.1
N$15
  Top 0.2: R9.1 LED7.1
N$16
  Top 0.2: R10.1 LED8.1
N$17
  Top 0.2: OK4.2 60.64,50.8 60.01,51.44 RN2.2
N$18
  Top 0.2: OK4.4 58.1,50.8 57.47,51.44 RN2.3
N$19
  Top 0.2: OK4.6 55.56,50.8 54.93,51.44 RN2.4
N$20
  Top 0.2: OK4.8 53.02,50.8 52.39,51.44 RN2.5
N$21
  Top 0.2: OK3.2 49.21,50.8 49.85,51.44 RN2.6
N$22
  Top 0.2: OK3.4 46.67,50.8 47.31,51.44 RN2.7
N$23
  Top 0.2: OK3.6 44.13,50.8 44.77,51.44 RN2.8
N$24
  Top 0.2: OK3.8 41.59,50.8 42.23,51.44 RN2.9
N$25
  Top 1.016: R2.1 23.62,69.09 D10.C 19.88,69.22 Q1.2
N$26
  Top 1.016: D9.A 8.89,71.75 | 8.89,71.75 R1.2 | Q1.1 8.89,71.75
N$27
  Top 1.016: X5.1.2 X5.1.1 35.92,76.69 29.07,76.69 R2.2
N$28  (via drill 0.35)
  Top 0.508: IC4.21 IC4.22 39.92,50.08 v40.01,50.16
  Top 1.016: X4.1.1 X4.1.2 58.1,62.67 D1.C
  Route2 0.508: v40.01,50.16 40.01,57.78 45.72,63.5 54.97,63.5 X4.1.2
  Bottom 0.2: D19.A 51.12,61.59 56.16,66.64 X4.1.2
N$29  (via drill 0.35)
  Top 0.508: IC4.23 IC4.24 39,51.38 v39.05,51.44
  Top 1.016: X4.2.1 X4.2.2 53.1,62.59 D2.C
  Route2 0.508: v39.05,51.44 39.05,58.1 45.4,64.45 50.92,64.45 X4.2.2
  Bottom 0.2: X4.2.2 48.58,62.11 D20.A
N$30  (via drill 0.35)
  Top 0.508: IC4.25 IC4.26 38.08,52.68 v38.1,52.7
  Top 1.016: X3.1.1 X3.1.2 47.94,62.67 D3.C
  Route2 0.508: v38.1,52.7 38.1,58.42 46.31,66.64 X3.1.2
  Bottom 0.2: X3.1.2 47.9,66.64 46.04,64.77 D21.A
N$31  (via drill 0.35)
  Top 0.508: IC4.27 IC4.28 v37.14,53.98 v37.15,53.98
  Top 1.016: X3.2.1 X3.2.2 42.94,62.59 D4.C
  Route2 0.508: v37.15,53.98 37.15,58.74 42.94,64.53 X3.2.2
  Bottom 0.2: X3.2.2 43.5,66.08 D22.A
N$32  (via drill 0.35)
  Top 0.508: IC4.29 IC4.30 39.73,55.28 v40.96,56.52
  Top 1.016: X2.1.1 X2.1.2 78.42,62.67 D5.C
  Route15 0.508: v40.96,56.52 45.09,60.64 72.43,60.64 X2.1.2
  Bottom 0.2: X2.1.2 73.7,61.91 61.91,61.91 60.96,60.96 D23.A
N$33  (via drill 0.35)
  Top 0.508: IC4.31 IC4.32 36.26,56.58 37.47,57.78 v37.47,60.64
  Top 1.016: X2.2.1 X2.2.2 73.42,62.59 D6.C
  Route15 0.508: v37.47,60.64 37.47,60.96 38.1,61.59 68.38,61.59 X2.2.2
  Bottom 0.2: X2.2.2 69.65,62.87 60.01,62.87 58.74,61.59 D24.A
N$34  (via drill 0.35)
  Top 0.508: IC4.33 IC4.34 35.98,57.88 36.2,58.1 v36.2,61.91
  Top 1.016: X1.1.1 X1.1.2 68.26,62.67 D7.C
  Route15 0.508: v36.2,61.91 36.83,62.55 64.17,62.55 X1.1.2
  Bottom 0.2: D25.A 56.2,61.59 58.42,63.82 65.44,63.82 X1.1.2
N$35  (via drill 0.35)
  Top 0.508: IC4.35 IC4.36 34.86,62.16 v35.88,63.18
  Top 1.016: X1.2.1 X1.2.2 63.26,62.59 D8.C
  Route15 0.508: v35.88,63.18 36.2,63.5 60.12,63.5 X1.2.2
  Bottom 0.2: D26.A 53.66,61.59 56.83,64.77 61.4,64.77 X1.2.2
N$36  (via drill 0.2)
  Top 0.2: OK4.10 v54.29,42.23 | v89.22,62.23 R3.2 | v57.15,36.51 IC2.2
  Bottom 0.2: v57.15,36.51 57.15,39.37 v54.29,42.23 54.29,44.77 55.24,45.72 76.2,45.72 89.22,58.74 v89.22,62.23
N$37  (via drill 0.2)
  Top 0.2: OK4.12 v56.83,42.23 | v89.22,54.61 R4.2 | v57.15,35.24 IC2.3
  Bottom 0.2: v57.15,35.24 58.1,36.2 58.1,39.37 56.83,40.64 v56.83,42.23 56.83,44.45 57.47,45.09 79.69,45.09 v89.22,54.61
N$38  (via drill 0.2)
  Top 0.2: OK4.14 v59.37,42.23 | v89.22,46.99 R5.2 | v57.15,33.97 IC2.4
  Bottom 0.2: v57.15,33.97 57.78,33.97 59.05,35.24 59.05,39.37 59.37,39.69 v59.37,42.23 59.37,43.81 60.01,44.45 86.68,44.45 v89.22,46.99
N$39  (via drill 0.2)
  Top 0.2: OK4.16 v61.91,42.23 | v89.22,39.37 R6.2 | v57.15,32.7 IC2.5
  Bottom 0.2: v57.15,32.7 57.78,32.7 60.01,34.92 60.01,39.05 61.91,40.96 v61.91,42.23 61.91,43.18 62.55,43.81 84.77,43.81 v89.22,39.37
N$40  (via drill 0.2)
  Top 0.2: OK3.10 v42.86,42.23 | v50.16,31.43 IC2.6 | v89.22,31.75 R7.2
  Route15 0.2: v50.16,31.43 54.29,31.43 59.05,26.67 75.25,26.67 80.33,31.75 v89.22,31.75
  Bottom 0.2: v42.86,42.23 50.16,34.92 v50.16,31.43
N$41  (via drill 0.2)
  Top 0.2: OK3.12 v45.4,42.23 | v51.12,30.16 IC2.7 | v89.53,24.13 R8.2
  Route15 0.2: v60.96,24.13 53.66,24.13 51.12,26.67 v51.12,30.16
  Bottom 0.2: v45.4,42.23 51.12,36.51 v51.12,30.16 | v60.96,24.13 v89.53,24.13
N$42  (via drill 0.2)
  Top 0.2: OK3.14 v47.94,42.23 | v52.07,28.89 IC2.8 | v89.22,16.51 R9.2
  Route15 0.2: v56.83,24.77 53.98,24.77 52.07,26.67 v52.07,28.89
  Bottom 0.2: v47.94,42.23 52.07,38.1 v52.07,28.89 | v56.83,24.77 58.1,23.5 82.23,23.5 v89.22,16.51
N$43  (via drill 0.2)
  Top 0.2: OK3.16 v50.48,42.23 | v53.02,27.62 IC2.9 | v89.22,8.89 R10.2
  Bottom 0.2: v50.48,42.23 50.48,40.96 53.02,38.42 v53.02,27.62 57.78,22.86 75.25,22.86 v89.22,8.89
N$44
  Top 0.254: IC3.19 84.14,36.51 84.77,37.15 84.77,55.88 87.63,58.74 87.63,66.04 88.9,67.31 R19.1
N$45
  Top 0.254: IC3.18 84.14,35.24 85.41,36.51 85.41,55.56 89.53,59.69 R20.1
N$46
  Top 0.254: IC3.17 84.14,33.97 86.04,35.88 86.04,50.8 87.31,52.07 R21.1
N$47
  Top 0.254: IC3.16 84.14,32.7 86.68,35.24 86.68,43.18 87.95,44.45 R22.1
N$48
  Top 0.254: IC3.15 84.14,31.43 89.53,36.83 R23.1
N$49
  Top 0.254: IC3.14 87,30.16 87.95,29.21 R24.1
N$50
  Top 0.254: IC3.13 84.14,28.89 87.95,25.08 87.95,22.86 89.22,21.59 R25.1
N$51
  Top 0.254: IC3.12 83.82,27.62 86.68,24.77 86.68,16.83 89.53,13.97 R26.1
N$52
  Top 0.254: R19.2 LED1.3
N$53
  Top 0.254: R20.2 LED2.3
N$54
  Top 0.2: OK1.2 R11.2
N$55
  Top 0.2: OK1.4 R12.2
N$56
  Top 0.2: OK1.6 R13.2
N$57
  Top 0.2: OK1.8 R14.2
N$58
  Top 0.2: OK2.2 R15.2
N$59
  Top 0.254: R21.2 LED3.3
N$60
  Top 0.2: OK2.4 R16.2
N$61
  Top 0.2: OK2.6 R17.2
N$62
  Top 0.2: OK2.8 R18.2
N$63
  Top 0.2: IC1.17 8.26,24.77 9.21,25.72 OK1.5
N$64
  Top 0.2: IC1.18 6.99,25.4 6.67,25.72 OK1.3
N$65
  Top 0.2: IC1.19 5.71,24.13 4.13,25.72 OK1.1
N$66
  Top 0.2: IC1.16 9.53,24.13 11.75,26.35 OK1.7
N$67
  Top 0.2: IC1.15 10.79,24.45 11.75,25.4 13.34,25.4 14.92,26.99 14.92,30.48 15.56,31.11 OK2.1
N$68
  Top 0.2: IC1.14 12.06,24.45 12.7,25.08 17.14,25.08 18.1,26.04 OK2.3
N$69
  Top 0.2: OK2.5 20.64,26.04 19.37,24.77 13.65,24.77 13.34,24.45 IC1.13
N$70
  Top 0.2: IC1.12 14.61,24.13 14.92,24.45 21.91,24.45 23.18,25.72 OK2.7
N$71
  Top 0.254: R22.2 LED4.3
N$72
  Top 0.254: R23.2 LED5.3
N$73
  Top 0.254: R24.2 LED6.3
N$74
  Top 0.254: R25.2 LED7.3
N$75
  Top 0.254: R26.2 LED8.3
N$76  (via drill 0.2)
  Top 0.2: OK3.1 50.48,50.8 51.12,51.44 v51.12,54.93
  Bottom 0.2: v51.12,54.93 D19.C
N$77  (via drill 0.2)
  Top 0.2: OK3.3 47.94,50.8 48.58,51.44 v48.58,54.93
  Bottom 0.2: v48.58,54.93 D20.C
N$78  (via drill 0.2)
  Top 0.2: OK3.5 45.4,50.8 46.04,51.44 v46.04,54.93
  Bottom 0.2: v46.04,54.93 D21.C
N$79  (via drill 0.2)
  Top 0.2: OK3.7 42.86,50.8 43.5,51.44 v43.5,54.93
  Bottom 0.2: v43.5,54.93 D22.C
N$80  (via drill 0.2)
  Top 0.2: OK4.1 61.91,50.8 60.96,51.75 v60.96,54.93
  Bottom 0.2: v60.96,54.93 D23.C
N$81  (via drill 0.2)
  Top 0.2: OK4.3 59.37,50.8 58.74,51.44 v58.74,54.93
  Bottom 0.2: v58.74,54.93 D24.C
N$82  (via drill 0.2)
  Top 0.2: OK4.5 56.83,50.8 56.2,51.44 v56.2,54.93
  Bottom 0.2: v56.2,54.93 D25.C
N$83  (via drill 0.2)
  Top 0.2: OK4.7 54.29,50.8 53.66,51.44 v53.66,54.93
  Bottom 0.2: v53.66,54.93 D26.C
N$97
  Top 0.2: Q2.3 39.52,23.98 40.23,23.27 U1.7
N$99
  Top 0.152: R50.1 JP1.2
N$100
  Top 0.254: D14.C 69.53,5.71 69.97,5.28 U$19.1
N$101
  Top 0.254: D11.C 70.8,18.41 73.77,15.45 U$19.2
N$102
  Top 0.254: D12.C 67.56,0.64 73.98,0.64 74.97,1.63 U$19.4
N$103
  Top 0.254: D13.C 67.63,15.88 68.06,15.45 U$19.8
N$104
  Top 0.254: D15.C 77.47,8.26 80.13,5.59 U$20.1
N$105
  Top 0.254: D16.C 66.99,13.34 67.94,12.38 84.14,12.38 85.13,13.38 U$20.2
N$106
  Top 0.254: D17.C 80.01,10.79 85.13,5.67 U$20.4
N$107
  Top 0.254: D18.C 73.03,20.95 78.53,15.45 U$20.8
OUTS  (via drill 0.2)
  Top 0.254: U1.2 44.23,22.95 v45.09,23.81 | v17.46,22.86 17.41,22.81 IC1.11
  Route2 0.254: v45.09,23.81 44.13,22.86 v17.46,22.86
RESET  (via drill 0.2)
  Top 0.254: v35.56,20.32 J1.5 R49.1 | v45.09,17.78 45.48,18.18 U1.29
  Route15 0.254: v35.56,20.32 38.1,17.78 v45.09,17.78
RXD  (via drill 0.2)
  Top 0.2: IC5.4 v18.41,17.46
  Top 0.254: v45.09,18.73 45.33,18.98 U1.30
  Route2 0.2: v18.41,17.46 19.37,16.51 42.86,16.51 44.77,18.41
  Route2 0.254: 44.77,18.41 v45.09,18.73
SCK  (via drill 0.2)
  Top 0.254: J1.3 35.56,17.78 v35.88,17.46 | v38.1,13.97 38.58,13.49 U1.17
  Bottom 0.254: v35.88,17.46 38.1,15.24 v38.1,13.97
TXD  (via drill 0.2)
  Top 0.2: IC5.1 23.39,19.27 v23.5,19.37
  Top 0.254: U1.31 46.42,19.68 v45.09,19.68
  Route2 0.2: v23.5,19.37 29.84,19.37 30.8,18.41 43.5,18.41 44.77,19.68 v45.09,19.68

### Text on the board
Top: MicroSPS / DO8-1 V1.1 / 04.07.20 / Marco Müller
tNames: MicroSPS / DO8-1 V1.1 / 04.07.20 / Marco Müller
Aktuelles_Bauteil: BST-Plan für die Bauteile mit Value: SPT2.5/2-H-5.0_SPT2_[] (Anzahl: 5 / n.b.: 0) | vorne | vorne | vorne | vorne | vorne
225bmp: R1 | Q1 | D10 | R19 | LED1 | R2 | D9 | IC4 | D4 | D3 | D2 | D1 | D8 | D7 | D6 | D5 | R20 | R3 | LED2 | C8 | R21 | R4 | LED3 | RN2 | OK3 | OK4 | R22 | R5 | LED4 | RN1 | IC2 | C3 | IC3 | C6 | R23 | R6 | LED5 | OK1 | OK2 | Q2 | C1 | R24 | R7 | LED6 | R11 | R12 | R13 | R14 | R15 | R16 | R17 | R18 | C4 | R25 | R8 | LED7 | R49 | D18 | U1 | D11 | C5 | D13 | J1 | IC1 | D16 | R26 | R9 | LED8 | D17 | D15 | R10 | IC5 | C7 | D14 | C2 | R50 | JP3 | JP2 | D12 | JP1